# EasyEDA Pro project PID调试器.eprj

# Schematic Schematic1
Board Name: Board1; Create Date: 2025-07-22; Page Name: P1; Project Name: PID调试器; Schematic Name: Schematic1; Update Date: 2025-07-23; Company: 嘉立创EDA; Page Size: A4; Version: V1.0
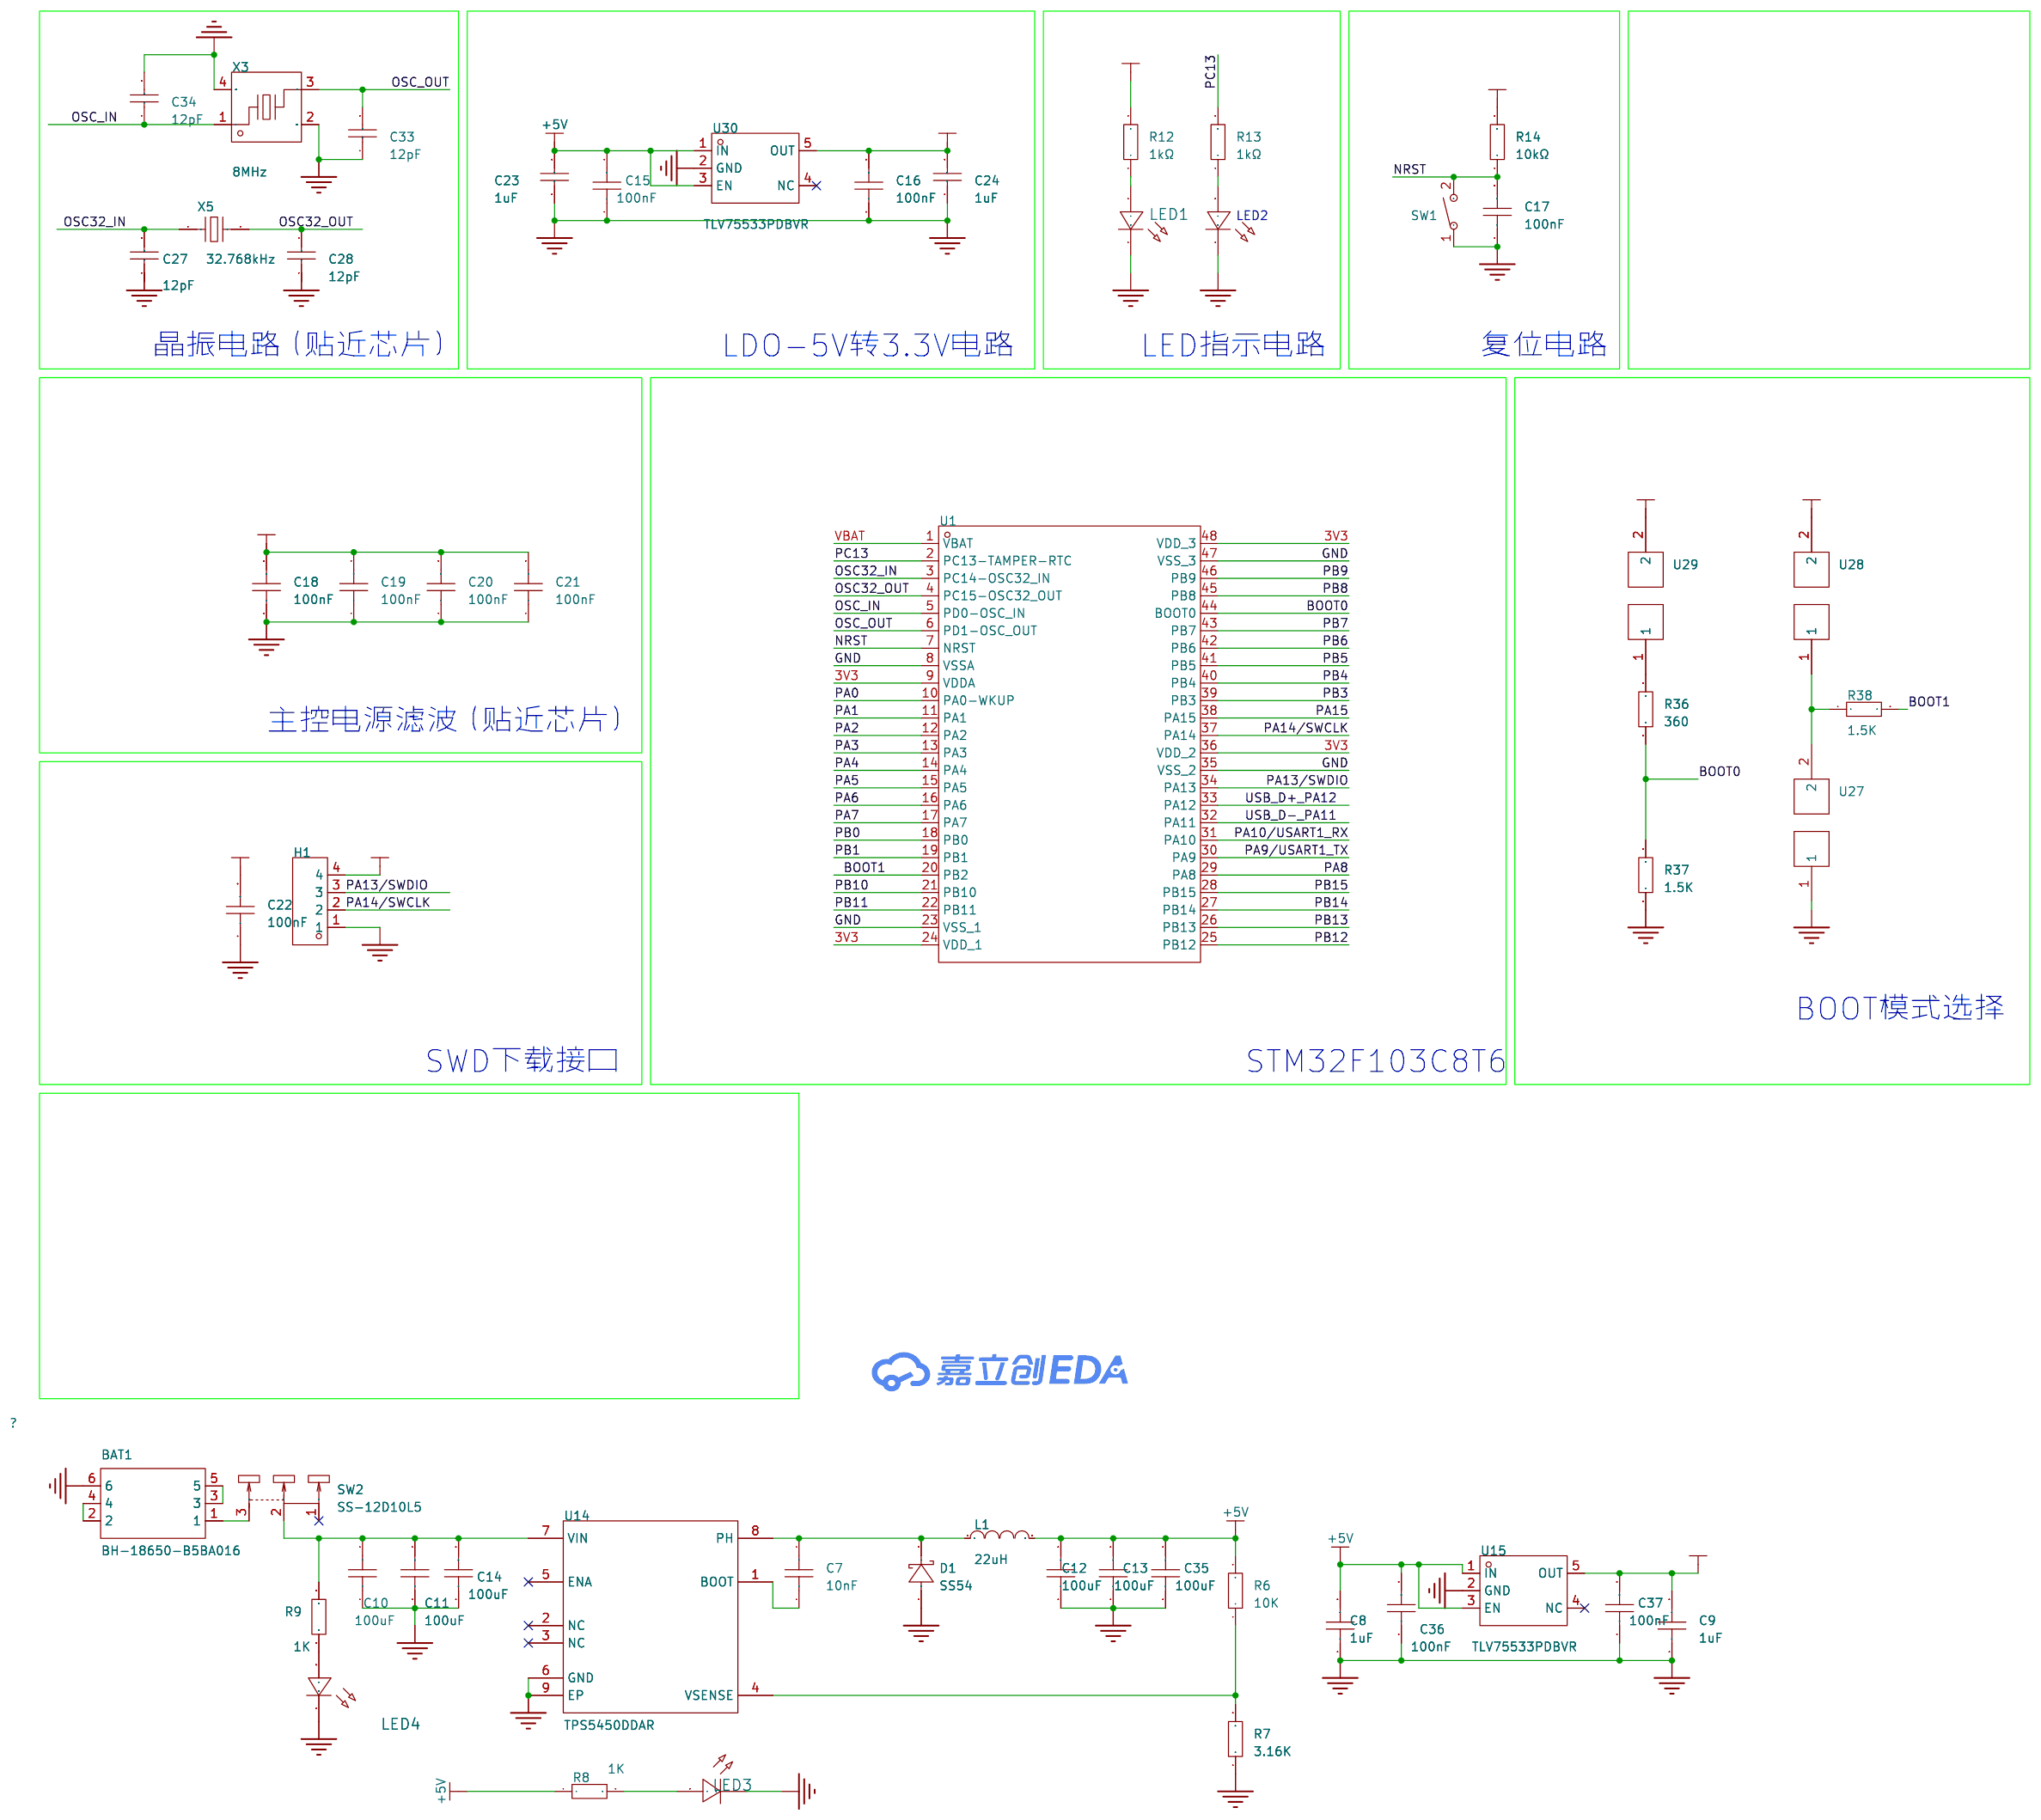
[diagram p0: schematic sheet]

## Parts
BAT1  BH-18650-B5BA016  [BAT-SMD_BH-18650-B5BA016]
C7  100nF  [C0603]
C8  100nF  [C0603]
C9  100nF  [C0603]
C10  100uF  [C1206]
C11  100uF  [C1206]
C12  100uF  [C1206]
C13  100uF  [C1206]
C14  100uF  [C1206]
C15  100nF  [R0402]
C16  100nF  [R0402]
C17  100nF  [R0402]
C18  100nF  [R0402]
C19  100nF  [R0402]
C20  100nF  [R0402]
C21  100nF  [R0402]
C22  100nF  [R0402]
C23  1uF  [R0402]
C24  1uF  [R0402]
C27  12pF  [R0402]
C28  12pF  [R0402]
C33  12pF  [R0402]
C34  12pF  [R0402]
C35  100uF  [C1206]
C36  100nF  [R0402]
C37  100nF  [R0402]
D1  SS54  [SMA_L4.3-W2.6-LS5.0-FD]
H1  -  [HDR-TH_4P-P2.54-V-M]
L1  22uH  [IND-SMD_L7.1-W6.6]
LED1  -  [LED_0603]
LED2  -  [LED_0603]
LED3  -  [LED_0603]
LED4  -  [LED_0603]
R6  10K  [R0603]
R7  10K  [R0603]
R8  1K  [R0603]
R9  1K  [R0603]
R12  1kΩ  [R0402]
R13  1kΩ  [R0402]
R14  10kΩ  [R0402]
R36  360  [R0603]
R37  1.5K  [R0603]
R38  1.5K  [R0603]
SW1  TS-1101-B-W  [KEY-SMD_2P-L6.0-W3.6-P7.4-LS8.0-L]
SW2  SS-12D10L5  [SW-TH_SS-12D10L5]
U1  STM32F103C8T6  [LQFP-48_L7.0-W7.0-P0.50-LS9.0-BL]
U14  TPS5450DDAR  [SOP-8_L4.9-W3.9-P1.27-LS6.0-BL-EP]
U15  TLV75533PDBVR  [SOT-23-5_L3.0-W1.7-P0.95-LS2.8-BR]
U27  -  [空焊盘]
U28  -  [空焊盘]
U29  -  [空焊盘]
U30  TLV75533PDBVR  [SOT-23-5_L3.0-W1.7-P0.95-LS2.8-BR]
X3  8MHz  [CRYSTAL-SMD_4P-L3.2-W2.5-BL-1]
X5  32.768kHz  [OSC-SMD_L3.2-W1.5]

## Library data of the parts
BAT1 = BH-18650-B5BA016: LCSC Part Name: 电池盒; Supplier Part: C19184086; Manufacturer: MYOUNG(美阳); Supplier Footprint: SMD; JLCPCB Part Class: 扩展库; Datasheet: https://atta.szlcsc.com/upload/public/pdf/source/20231108/D1617EC59CD55304B33DC60D90FEF183.pdf; Supplier: LCSC; Connector Type: 电池盒; Contact Plating: 金; Operating Temperature Range: -25℃~+85℃
C7-C9 = CAP_0603: Supplier Footprint: 0603
C10-C14 C35 = HGC1206R5107M100NSPJ: 容值:100uF;精度:±20%;额定电压:10V;材质(温度系数):X5R;; LCSC Part Name: 100uF ±20% 10V; Supplier Part: C7432784; Manufacturer: Chinocera(华瓷); Supplier Footprint: 1206; JLCPCB Part Class: 扩展库; Datasheet: https://atta.szlcsc.com/upload/public/pdf/source/20240320/FAC3FEC40A78BC5CCCE96C232A94D860.pdf; Supplier: LCSC; Tolerance: ±20%; Voltage Rated: 10V; Temperature Coefficient: X5R
C15-C22 C36 C37 = GRM155R71H104KE14D: 容值:100nF;精度:±10%;额定电压:50V;材质(温度系数):X7R;; LCSC Part Name: 100nF ±10% 50V; Supplier Part: C77020; Manufacturer: muRata(村田); Supplier Footprint: 0402; JLCPCB Part Class: 扩展库; Datasheet: https://atta.szlcsc.com/upload/public/pdf/source/20180326/C77020_39BD49C951FF1AF0DB1F1FAC5AC1E401.pdf; Supplier: LCSC; Tolerance: ±10%; Voltage Rated: 50V; Temperature Coefficient: X7R
C23 C24 = CL05A105KP5NNNC: 容值:1uF;精度:±10%;额定电压:10V;材质(温度系数):X5R;; LCSC Part Name: 1uF ±10% 10V; Supplier Part: C14445; Manufacturer: SAMSUNG(三星); Supplier Footprint: 0402; JLCPCB Part Class: 扩展库; Datasheet: https://atta.szlcsc.com/upload/public/pdf/source/20160218/1457707763339.pdf; Supplier: LCSC; Tolerance: ±10%; Voltage Rated: 10V; Temperature Coefficient: X5R
C27 C28 C33 C34 = 0402CG120J500NT: 容值:12pF;精度:±5%;额定电压:50V;材质(温度系数):C0G;; LCSC Part Name: 12pF ±5% 50V; Supplier Part: C1547; Manufacturer: FH(风华); Supplier Footprint: 0402; JLCPCB Part Class: 基础库; Datasheet: https://atta.szlcsc.com/upload/public/pdf/source/20200305/C486355_26A10D38EF8C2A5C37091D0039909270.pdf; Supplier: LCSC; Tolerance: ±5%; Voltage Rated: 50V; Temperature Coefficient: C0G
D1 = SS54_C7420369: 二极管配置:独立式;正向压降(Vf):550mV@5.0A;直流反向耐压(Vr):40V;整流电流:5A;; LCSC Part Name: 电压:40V 电流:5A; Supplier Part: C7420369; Manufacturer: 宏迦橙; Supplier Footprint: SMA(DO-214AC); Datasheet: https://atta.szlcsc.com/upload/public/pdf/source/20230828/254C3882F8647358AD9F60DD73611B5E.pdf; Supplier: LCSC; Diode Configuration: 独立式; Forward Voltage (Vf@If): 550mV@5.0A; Reverse Voltage (Vr): 40V; Rectified Current: 5A; Reverse Leakage Current (Ir): 50uA@40V
H1 = HDR-M_2.54_1x4P: Supplier Part: C2935929; Supplier Footprint: 插件
L1 = YSPI0630A-220M: 电感值:22uH;精度:±20%;额定电流:3A;; LCSC Part Name: 22uH ±20%; Supplier Part: C497873; Manufacturer: YJYCOIN(益嘉源); Supplier Footprint: SMD,6.6x7.1mm; JLCPCB Part Class: 扩展库; Datasheet: https://atta.szlcsc.com/upload/public/pdf/source/20200317/C497869_D09F597887D5FB8B541C5C98B400E286.pdf; Supplier: LCSC; Tolerance: ±20%; Rated Current: 3A; DC Resistance (DCR): 130mΩ
LED1 = LED_0603-R: Supplier Footprint: 0603; Supplier Part: C84263
LED2 = LED_0603-B: Supplier Footprint: 0603; Supplier Part: C84266
LED3 LED4 = LED_0603-R: Supplier Footprint: 0603
R6-R9 R36-R38 = Res_0603: Supplier Footprint: 0603
R12 R13 = 0402WGF1001TCE: 电阻类型:厚膜电阻;阻值:1kΩ;精度:±1%;功率:62.5mW;最大工作电压:50V;温度系数:±100ppm/℃;; LCSC Part Name: 1kΩ ±1% 62.5mW 厚膜电阻; Supplier Part: C11702; Manufacturer: UNI-ROYAL(厚声); Supplier Footprint: 0402; JLCPCB Part Class: 基础库; Datasheet: https://atta.szlcsc.com/upload/public/pdf/source/20200306/C422600_1E6D84923E4A46A82E41ADD87F860B5C.pdf; Supplier: LCSC; Type: 厚膜电阻; Tolerance: ±1%; Power(Watts): 62.5mW; Overload Voltage (Max): 50V; Temperature Coefficient: ±100ppm/℃; Operating Temperature Range: -55℃~+155℃
R14 = RC0402FR-0710KL: 电阻类型:厚膜电阻;阻值:10kΩ;精度:±1%;功率:62.5mW;最大工作电压:50V;温度系数:±100ppm/℃;; LCSC Part Name: 厚膜电阻 10kΩ ±1% 62.5mW; Supplier Part: C60490; Manufacturer: YAGEO(国巨); Supplier Footprint: 0402; JLCPCB Part Class: 扩展库; Datasheet: https://atta.szlcsc.com/upload/public/pdf/source/20170925/C131467_1506321478108990263.pdf; Supplier: LCSC; Type: 厚膜电阻; Tolerance: ±1%; Power(Watts): 62.5mW; Overload Voltage (Max): 50V; Temperature Coefficient: ±100ppm/℃; Operating Temperature Range: -55℃~+155℃
SW1 = TS-1101-B-W_C500065: 触点电流:50mA;额定电压(DC):12V;绝缘电阻:-;电路结构:单刀单掷;安装方式:立贴;带灯:无;作用力:160gf;机械寿命:5万次;带支架:否;; LCSC Part Name: 6*3.6*2.5mm 立贴 轻触开关; Supplier Part: C500065; Manufacturer: XKB Connectivity(中国星坤); Supplier Footprint: SMD; JLCPCB Part Class: 扩展库; Datasheet: https://atta.szlcsc.com/upload/public/pdf/source/20211011/D0E0CAF534F7B19DDE4CE68748A25BD3.pdf; Supplier: LCSC; Contact Current: 50mA; Voltage Rating (DC): 12V; Circuit: 单刀单掷; Mounting Style: 立贴; Actuator Style: 矩形按钮; Actuator/Cap Color: 白色; With Lamp: 无; Operating Force: 160gf; Mechanical Life: 5万次; Operating Temperature: -30℃~+85℃; Switch Length: 6mm; Switch Width: 3.6mm; Switch Height: 2.5mm; Strike Gundam: 否
SW2 = SS-12D10L5: 电路结构:单刀双掷;安装方式:直插;开关颜色:黑色;额定电流(DC):3A;额定电压(DC):125V;额定电流(AC):3A;额定电压(AC):125V;机械寿命:1万次;; LCSC Part Name: 柄长5mm 直插双档 滑动开关; Supplier Part: C319012; Manufacturer: XKB Connectivity(中国星坤); Supplier Footprint: 插件; Datasheet: https://atta.szlcsc.com/upload/public/pdf/source/20211009/D6412F37AABE6F9459A6EE7FA4DAEADB.pdf; Supplier: LCSC; Circuit: 单刀双掷; Actuator Style: 矩形柱状; Pin Style: PC引脚; Switch Length: 13mm; Switch Width: 6.8mm; Switch Height: 6.4mm; Mounting Style: 直插; Actuator Color: 黑色; Current Rating (DC): 3A; Voltage Rating (DC): 125V; Current Rating (AC): 3A; Voltage Rating (AC): 125V; Mechanical Life: 1万次; Operating Temperature: -40℃~+85℃
U1 = STM32F103C8T6: CPU内核:CM3;程序存储容量:64KB;RAM总容量:20KB;GPIO端口数量:37;工作电压范围:2V~3.6V;CPU最大主频:72MHz;程序存储器类型:FLASH;; LCSC Part Name: STM32F103C8T6 MSL=3; Supplier Part: C8734; Manufacturer: ST(意法半导体); Supplier Footprint: LQFP-48(7x7); JLCPCB Part Class: 扩展库; Datasheet: https://atta.szlcsc.com/upload/public/pdf/source/20220812/8363ACEC51AD55ECEB84799464F7CB85.pdf; Supplier: LCSC; CPU Core: CM3; Program Storage Size: 64KB; RAM Size: 20KB; GPIO Ports Number: 37; Operating Voltage Range: 2V~3.6V; CPU Maximum Speed: 72MHz; Program Memory Type: FLASH; Operating Temperature Range: -40℃~+85℃; ADC (Bit): 12bit; Universal Serial Bus: 有; Peripheral/Function: 看门狗；DMA；看门狗；片载温度传感器; Watchdog: 有; Infrared Data Association: 有; Low-Voltage Detect: 有; Direct Memory Access: 有; Internal Oscillator: 有
U14 = TPS5450DDAR: 功能类型:降压型;输出类型:可调;工作电压:5.5V~36V;输出电压:1.221V~31.32V;输出电流:5A;; LCSC Part Name: 5A宽输入范围降压转换器; Supplier Part: C114425; Manufacturer: TI(德州仪器); Supplier Footprint: SOP-8-EP-150mil; JLCPCB Part Class: 扩展库; Datasheet: https://www.ti.com/cn/lit/gpn/tps5450; Supplier: LCSC; Function: 降压型; Output Type: 可调; Input Voltage: 5.5V~36V; Output Voltage: 1.221V~31.32V; Output Current: 5A; Switching Frequency: 500kHz; Operating Temperature: -40℃~+125℃@(TJ); Synchronous Rectification: 否; Number of Outputs: 1; Topology: 降压式; Switch tube (built-in/external): 内置
U15 U30 = TLV75533PDBVR: 输出类型:固定;最大输入电压:5.5V;输出电压:3.3V;输出电流:500mA;电源纹波抑制比(PSRR):52dB;输出极性:正极;; LCSC Part Name: 具有使能功能的 500mA、高 PSRR、低 IQ、低压降稳压器; Supplier Part: C404027; Manufacturer: TI(德州仪器); Supplier Footprint: SOT-23-5; JLCPCB Part Class: 扩展库; Datasheet: https://www.ti.com/cn/lit/gpn/tlv755p; Supplier: LCSC; Output Type: 固定; Maximum Input Voltage: 5.5V; Output Voltage: 3.3V; Output Current: 500mA; Power Supply Rejection Ratio (PSRR): 52dB; Dropout Voltage: 238mV@(500mA); standby current: 31uA; Feature: 防静电保护；浪涌保护；低ESR；热保护(TSD)；欠压闭锁；过流保护(OCP)；带使能; Operating Temperature: -40℃~+125℃@(Tj); Output Polarity: 正极; Number of Outputs: 1
U27-U29 = 空焊盘
X3 = XL2EL89COI-111YLC-8M: 晶振类型:贴片晶振;频率:8MHz;常温频差:±10ppm;外接负载电容:12pF;频率稳定度(全温):±20ppm;; LCSC Part Name: 8MHz ±10ppm 12pF; Supplier Part: C2973805; Manufacturer: YXC(扬兴晶振); Supplier Footprint: SMD3225-4P; JLCPCB Part Class: 扩展库; Datasheet: https://atta.szlcsc.com/upload/public/pdf/source/20240329/19D5F850207469550BEB00D7DFEDBC7A.pdf; Supplier: LCSC; Crystal Type: 贴片晶振; Normal temperature Frequency Tolerance: ±10ppm; External load capacitor: 12pF; Frequency Stability(Full temperature range): ±20ppm; Equivalent Series Resistance (ESR): 150Ω; Operating Temperature: -40℃~+85℃
X5 = X321532768KGD2SI: 晶振类型:贴片晶振;频率:32.768kHz;常温频差:±20ppm;外接负载电容:12.5pF;频率稳定度(全温):-;; LCSC Part Name: 32.768kHz ±20ppm 12.5pF; Supplier Part: C620155; Manufacturer: YXC(扬兴晶振); Supplier Footprint: SMD3215-2P; JLCPCB Part Class: 扩展库; Datasheet: https://atta.szlcsc.com/upload/public/pdf/source/20240329/3A7650FD985DD0DE85694D3785AB4916.pdf; Supplier: LCSC; Crystal Type: 贴片晶振; Normal temperature Frequency Tolerance: ±20ppm; External load capacitor: 12.5pF; Operating Temperature: -40℃~+85℃

## Nets
3V3: C9.2 C18.2 C19.2 C20.2 C21.2 C22.2 C37.2 H1.4 R12.2 R14.2 U1.9(VDDA) U1.24(VDD_1) U1.36(VDD_2) U1.48(VDD_3) U15.5(OUT) U28.2 U29.2
+5V: C8.2 C12.2 C13.2 C15.2 C23.2 C35.2 C36.2 L1.2 R6.2 R8.1 U15.1(IN) U15.3(EN) U30.1(IN) U30.3(EN)
GND: BAT1.6 C8.1 C9.1 C10.1 C11.1 C12.1 C13.1 C14.1 C15.1 C16.1 C17.1 C18.1 C19.1 C20.1 C21.1 C22.1 C23.1 C24.1 C27.1 C28.1 C33.1 C34.2 C35.1 C36.1 C37.1 D1.1(A) H1.1 LED1.1(C) LED2.1(C) LED3.1(C) LED4.1(C) R7.1 R37.1 SW1.1 U1.8(VSSA) U1.23(VSS_1) U1.35(VSS_2) U1.47(VSS_3) U14.6(GND) U14.9(EP) U15.2(GND) U27.1 U30.2(GND) X3.2(GND) X3.4(GND)
VBAT: U1.1(VBAT)
ADC_3V3: C16.2 C24.2 U30.5(OUT)
BOOT0: R36.1 R37.2 U1.44(BOOT0)
BOOT1: R38.2 U1.20(PB2)
NRST: C17.2 R14.1 SW1.2 U1.7(NRST)
OSC32_IN: C27.2 U1.3(PC14-OSC32_IN) X5.1
OSC32_OUT: C28.2 U1.4(PC15-OSC32_OUT) X5.2
OSC_IN: C34.1 U1.5(PD0-OSC_IN) X3.1
OSC_OUT: C33.2 U1.6(PD1-OSC_OUT) X3.3
PA0: U1.10(PA0-WKUP)
PA1: U1.11(PA1)
PA2: U1.12(PA2)
PA3: U1.13(PA3)
PA4: U1.14(PA4)
PA5: U1.15(PA5)
PA6: U1.16(PA6)
PA7: U1.17(PA7)
PA8: U1.29(PA8)
PA9/USART1_TX: U1.30(PA9)
PA10/USART1_RX: U1.31(PA10)
PA13/SWDIO: H1.3 U1.34(PA13)
PA14/SWCLK: H1.2 U1.37(PA14)
PA15: U1.38(PA15)
PB0: U1.18(PB0)
PB1: U1.19(PB1)
PB3: U1.39(PB3)
PB4: U1.40(PB4)
PB5: U1.41(PB5)
PB6: U1.42(PB6)
PB7: U1.43(PB7)
PB8: U1.45(PB8)
PB9: U1.46(PB9)
PB10: U1.21(PB10)
PB11: U1.22(PB11)
PB12: U1.25(PB12)
PB13: U1.26(PB13)
PB14: U1.27(PB14)
PB15: U1.28(PB15)
PC13: R13.2 U1.2(PC13-TAMPER-RTC)
USB_D+_PA12: U1.33(PA12)
USB_D-_PA11: U1.32(PA11)
$1N1992: LED1.2(A) R12.1
$1N1995: LED2.2(A) R13.1
$1N3257: R38.1 U27.2 U28.1
$1N3260: R36.2 U29.1
$1N4251: C10.2 C11.2 C14.2 R9.2 SW2.2 U14.7(VIN)
$1N4254: C7.2 D1.2(K) L1.1 U14.8(PH)
$1N4256: C7.1 U14.1(BOOT)
$1N4260: R6.1 R7.2 U14.4(VSENSE)
$1N4266: LED3.2(A) R8.2
$1N4269: LED4.2(A) R9.1
$1N4271: BAT1.1 SW2.3
$1N6190: BAT1.2 BAT1.4
$1N6207: BAT1.3 BAT1.5

Not connected (* = marked no-connect by the designer): SW2 1*; U14 2(NC)* 3(NC)* 5(ENA)*; U15 4(NC)*; U30 4(NC)*

## Notes on the sheet
- 晶振电路（贴近芯片）
- LDO-5V转3.3V电路
- LED指示电路
- 复位电路
- 主控电源滤波（贴近芯片）
- BOOT模式选择
- SWD下载接口
- STM32F103C8T6

# Board PCB1
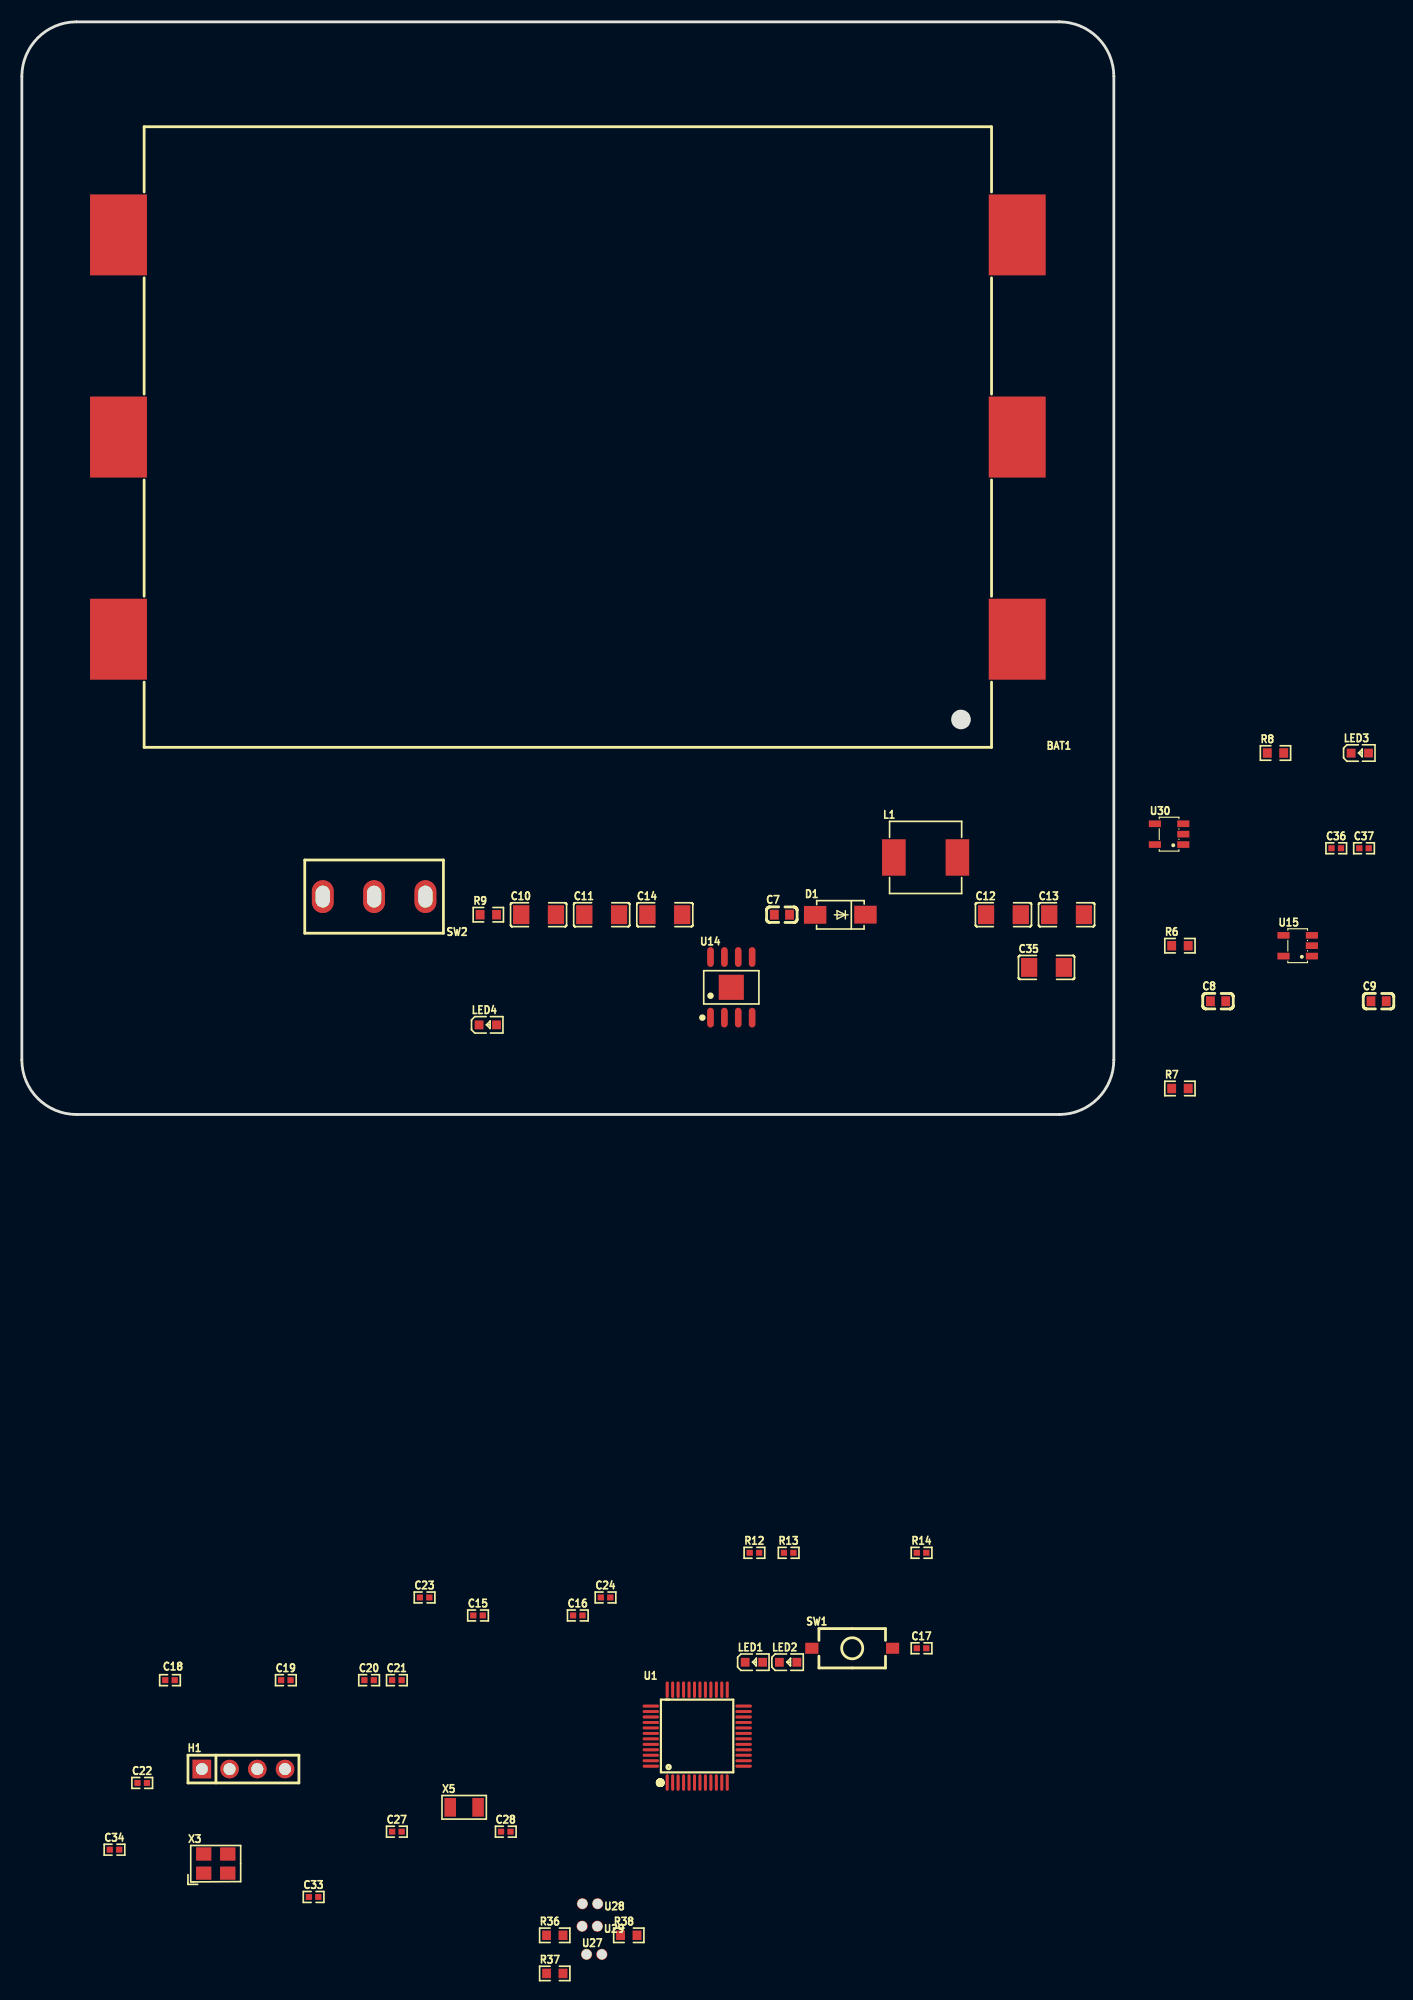
[diagram p1: board, top side]
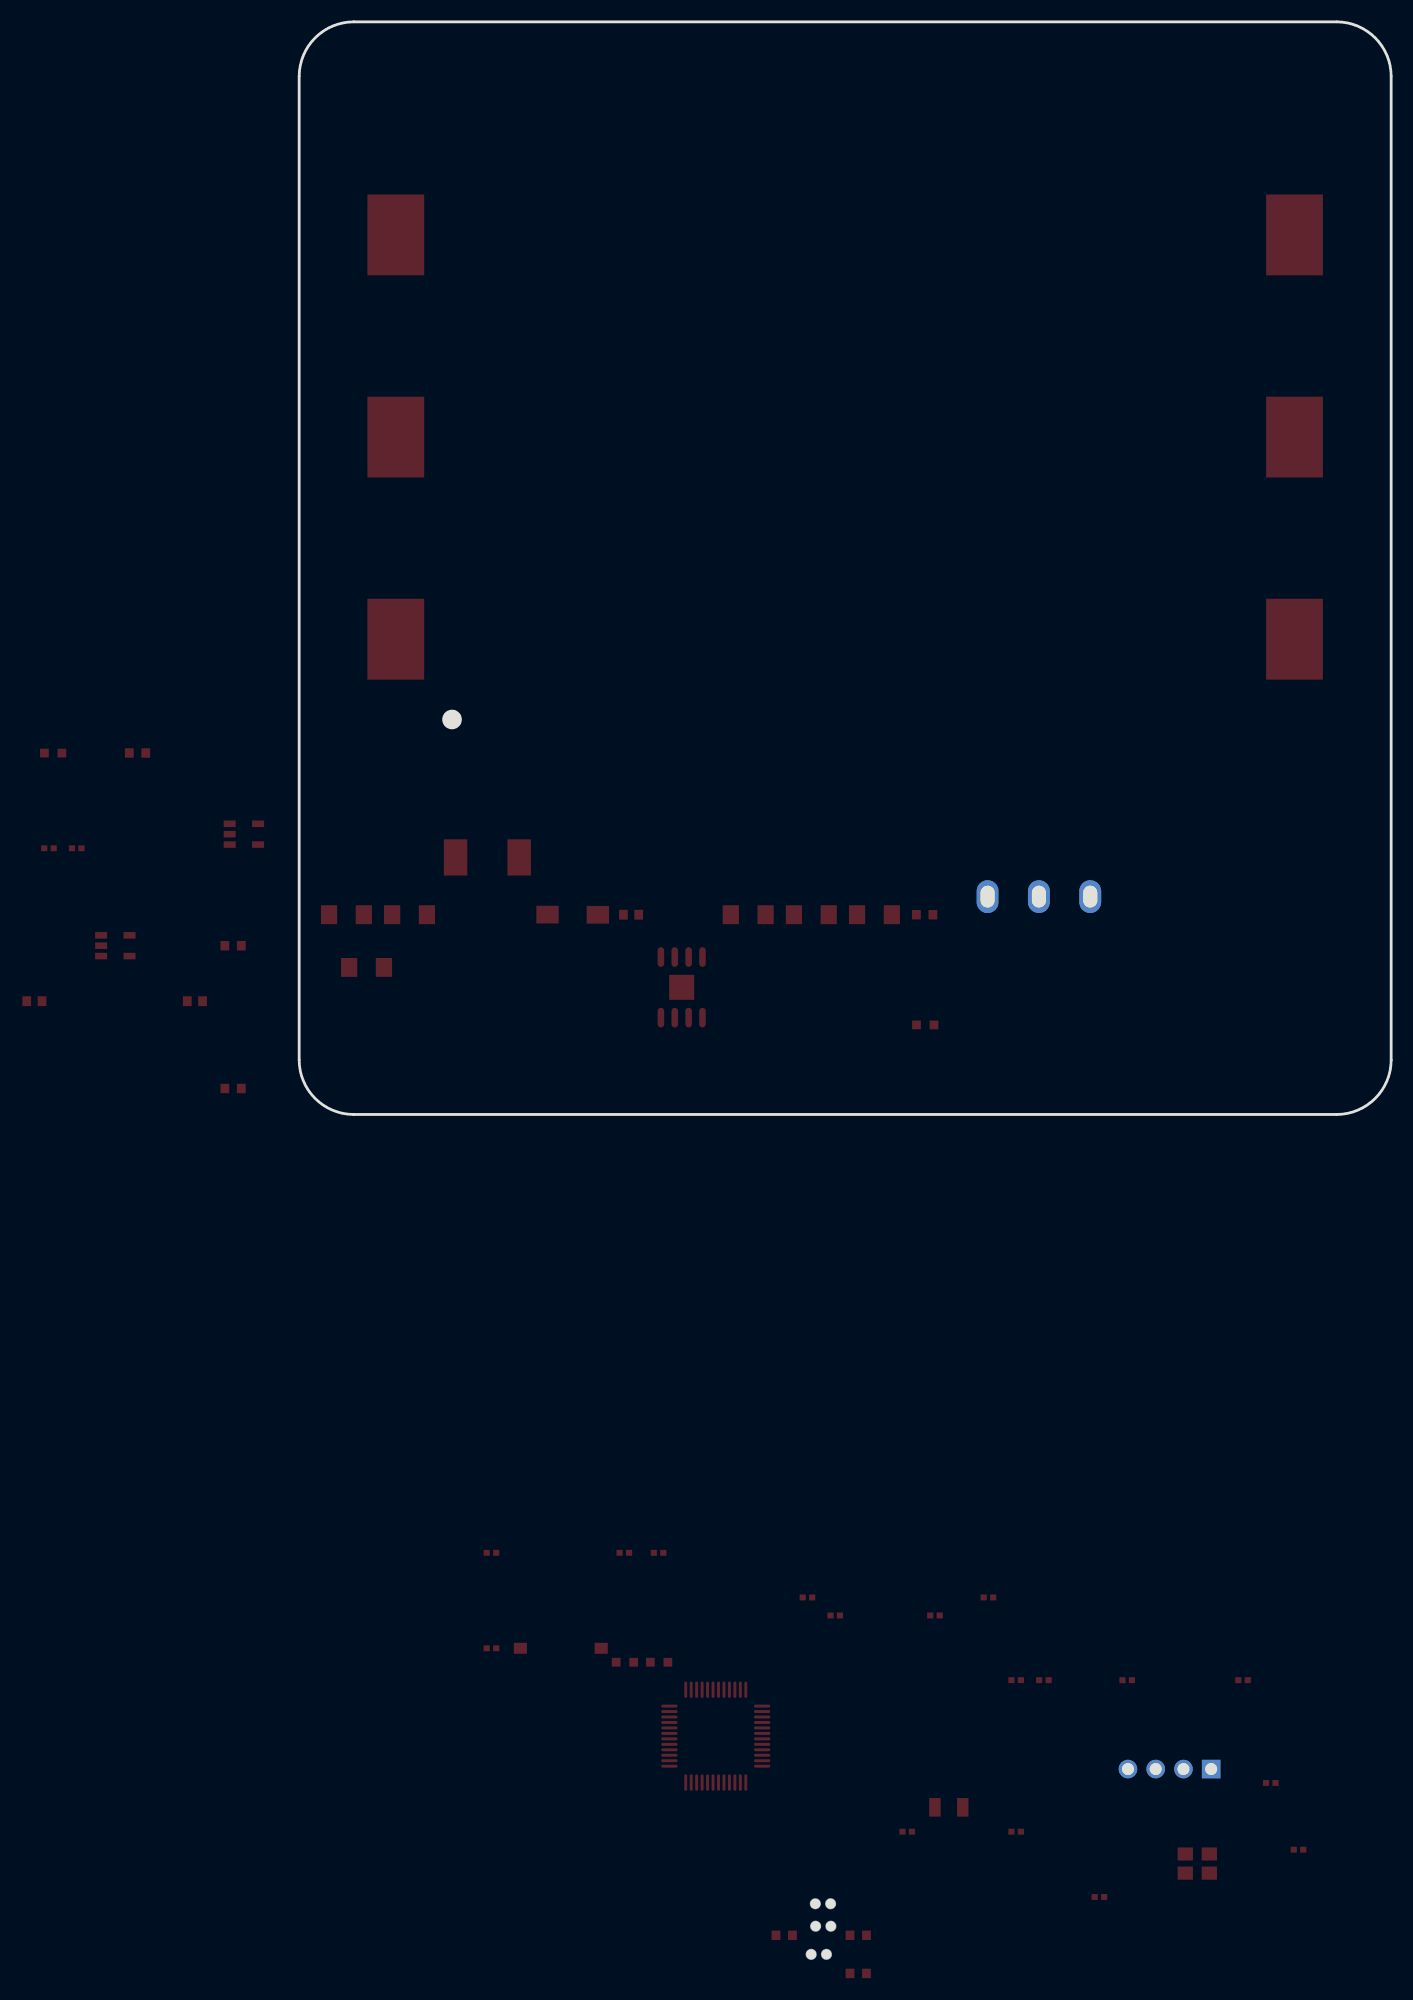
[diagram p2: board, bottom side, seen from below]

Outline 100 x 100 mm; copper layers: Top Layer, Bottom Layer. Coordinates in mm from the lower left corner of the outline.
Outline path: 0,95 0,5 arc(1.46,1.46) 5,0 95,0 arc(98.54,1.46) 100,5 100,95 arc(98.54,98.54) 95,100 5,100 arc(1.46,98.54) 0,95
Stack: Top Layer 0.035mm / Dielectric1 1.51mm FR4 er 4.5 / Bottom Layer 0.035mm

## Design rules (mm)
template: JLCPCB Capability(Two Layers Board)
spacing copperThickness1oz (default): track to track 0.102, other pairs 0.152 to 0.3
spacing copperThickness2oz: track to track 0.203, other pairs 0.152 to 0.3
track width copperThickness1oz (default): min 0.127, default 0.254, max 2.54
track width copperThickness2oz: min 0.203, default 0.254, max 2.54
differential pair differentialPair (default): width min 0.127, default 0.254, max 2.54; gap min 0.152, default 0.152
via viaSize (default): diameter min 0.5, default 0.61, max 10; hole min 0.3, default 0.305, max 6.3

## Placement (name value [footprint] x y rotation side)
BAT1  BH-18650-B5BA016  [BAT-SMD_BH-18650-B5BA016]  50 62 180 top
C7  100nF  [C0603]  69.6 18.28 0 top
C8  100nF  [C0603]  109.55 10.37 0 top
C9  100nF  [C0603]  124.25 10.37 0 top
C10  100uF  [C1206]  47.32 18.28 0 top
C11  100uF  [C1206]  53.1 18.28 0 top
C12  100uF  [C1206]  89.89 18.28 0 top
C13  100uF  [C1206]  95.67 18.28 0 top
C14  100uF  [C1206]  58.88 18.28 0 top
C15  100nF  [R0402]  41.78 -45.85 0 top
C16  100nF  [R0402]  50.91 -45.85 0 top
C17  100nF  [R0402]  82.39 -48.85 0 top
C18  100nF  [R0402]  13.57 -51.77 180 top
C19  100nF  [R0402]  24.18 -51.77 0 top
C20  100nF  [R0402]  31.8 -51.77 0 top
C21  100nF  [R0402]  34.34 -51.77 0 top
C22  100nF  [R0402]  11.02 -61.18 0 top
C23  1uF  [R0402]  36.88 -44.2 0 top
C24  1uF  [R0402]  53.45 -44.2 0 top
C27  12pF  [R0402]  34.34 -65.64 0 top
C28  12pF  [R0402]  44.32 -65.64 0 top
C33  12pF  [R0402]  26.72 -71.62 0 top
C34  12pF  [R0402]  8.48 -67.29 0 top
C35  100uF  [C1206]  93.83 13.46 0 top
C36  100nF  [R0402]  120.37 24.37 0 top
C37  100nF  [R0402]  122.91 24.37 0 top
D1  SS54  [SMA_L4.3-W2.6-LS5.0-FD]  74.95 18.28 0 top
H1  -  [HDR-TH_4P-P2.54-V-M]  20.29 -59.91 0 top
L1  22uH  [IND-SMD_L7.1-W6.6]  82.76 23.53 0 top
LED1  -  [LED_0603]  67.09 -50.12 0 top
LED2  -  [LED_0603]  70.22 -50.12 0 top
LED3  -  [LED_0603]  122.58 33.08 0 top
LED4  -  [LED_0603]  42.72 8.21 0 top
R6  10K  [R0603]  106.05 15.45 0 top
R7  10K  [R0603]  106.05 2.38 0 top
R8  1K  [R0603]  114.8 33.08 0 top
R9  1K  [R0603]  42.72 18.28 0 top
R12  1kΩ  [R0402]  67.09 -40.12 0 top
R13  1kΩ  [R0402]  70.22 -40.12 0 top
R14  10kΩ  [R0402]  82.39 -40.12 0 top
R36  360  [R0603]  48.8 -75.12 0 top
R37  1.5K  [R0603]  48.8 -78.61 0 top
R38  1.5K  [R0603]  55.58 -75.12 0 top
SW1  TS-1101-B-W  [KEY-SMD_2P-L6.0-W3.6-P7.4-LS8.0-L]  76.04 -48.85 0 top
SW2  SS-12D10L5  [SW-TH_SS-12D10L5]  32.26 19.94 180 top
U1  STM32F103C8T6  [LQFP-48_L7.0-W7.0-P0.50-LS9.0-BL]  61.85 -56.9 0 top
U14  TPS5450DDAR  [SOP-8_L4.9-W3.9-P1.27-LS6.0-BL-EP]  64.97 11.64 0 top
U15  TLV75533PDBVR  [SOT-23-5_L3.0-W1.7-P0.95-LS2.8-BR]  116.84 15.45 0 top
U27  -  [空焊盘]  51.72 -76.87 0 top
U28  -  [空焊盘]  52.73 -72.24 180 top
U29  -  [空焊盘]  52.71 -74.29 180 top
U30  TLV75533PDBVR  [SOT-23-5_L3.0-W1.7-P0.95-LS2.8-BR]  105.06 25.66 0 top
X3  8MHz  [CRYSTAL-SMD_4P-L3.2-W2.5-BL-1]  17.75 -68.56 0 top
X5  32.768kHz  [OSC-SMD_L3.2-W1.5]  40.51 -63.41 0 top

## Footprints (pads in the part's own frame, mm; a bottom-side part is the same pattern mirrored in y, then rotated)
BAT-SMD_BH-18650-B5BA016
  rect 5.2x7.4 smd: 1(-41.15,18.5) 2(41.15,18.5) 3(-41.15,0) 4(41.15,0) 5(-41.15,-18.5) 6(41.15,-18.5)
C0603
  rect 0.8x0.9 smd: 1(-0.7,0) 2(0.7,0)
C1206
  rect 1.485x1.728 smd: 1(-1.593,0) 2(1.593,0)
CRYSTAL-SMD_4P-L3.2-W2.5-BL-1
  rect 1.4x1.2 smd: 1(-1.1,-0.875) 2(1.1,-0.875) 3(1.1,0.875) 4(-1.1,0.875)
HDR-TH_4P-P2.54-V-M
  rect 1.7x1.7 hole 1.1: 1(-3.81,0)
  round 1.7 hole 1.1: 2(-1.27,0) 3(1.27,0) 4(3.81,0)
IND-SMD_L7.1-W6.6
  rect 2.15x3.32 smd: 1(-2.913,0) 2(2.913,0)
KEY-SMD_2P-L6.0-W3.6-P7.4-LS8.0-L
  rect 1.2x1 smd: 1(-3.7,0) 2(3.7,0)
LED_0603
  rect 0.8x0.8 smd: 1(-0.851,-0.01) 2(0.75,-0.005)
LQFP-48_L7.0-W7.0-P0.50-LS9.0-BL
  oval 0.27x1.5 smd: 1(-2.75,-4.25) 2(-2.25,-4.25) 3(-1.75,-4.25) 4(-1.25,-4.25) 5(-0.75,-4.25) 6(-0.25,-4.25) 7(0.25,-4.25) 8(0.75,-4.25) 9(1.25,-4.25) 10(1.75,-4.25) 11(2.25,-4.25) 12(2.75,-4.25) 25(2.75,4.25) 26(2.25,4.25) 27(1.75,4.25) 28(1.25,4.25) 29(0.75,4.25) 30(0.25,4.25) 31(-0.25,4.25) 32(-0.75,4.25) 33(-1.25,4.25) 34(-1.75,4.25) 35(-2.25,4.25) 36(-2.75,4.25)
  oval 1.5x0.27 smd: 13(4.25,-2.75) 14(4.25,-2.25) 15(4.25,-1.75) 16(4.25,-1.25) 17(4.25,-0.75) 18(4.25,-0.25) 19(4.25,0.25) 20(4.25,0.75) 21(4.25,1.25) 22(4.25,1.75) 23(4.25,2.25) 24(4.25,2.75) 37(-4.25,2.75) 38(-4.25,2.25) 39(-4.25,1.75) 40(-4.25,1.25) 41(-4.25,0.75) 42(-4.25,0.25) 43(-4.25,-0.25) 44(-4.25,-0.75) 45(-4.25,-1.25) 46(-4.25,-1.75) 47(-4.25,-2.25) 48(-4.25,-2.75)
OSC-SMD_L3.2-W1.5
  rect 1.05x1.7 smd: 1(-1.275,0) 2(1.275,0)
R0402
  rect 0.566x0.54 smd: 1(-0.433,0) 2(0.433,0)
R0603
  rect 0.806x0.864 smd: 1(-0.753,0) 2(0.753,0)
SMA_L4.3-W2.6-LS5.0-FD
  rect 2.046x1.62 smd: 1(-2.304,-0.009) 2(2.304,0.009)
SOP-8_L4.9-W3.9-P1.27-LS6.0-BL-EP
  oval 0.6x1.8 smd: 1(-1.905,-2.772) 2(-0.635,-2.772) 3(0.635,-2.772) 4(1.905,-2.772) 5(1.905,2.772) 6(0.635,2.772) 7(-0.635,2.772) 8(-1.905,2.772)
  rect 2.29x2.29 smd: 9(0,0)
SOT-23-5_L3.0-W1.7-P0.95-LS2.8-BR
  rect 1.1x0.6 smd: 1(1.3,-0.95) 2(1.3,0) 3(1.3,0.95) 4(-1.3,0.95) 5(-1.3,-0.95)
SW-TH_SS-12D10L5
  oval 2x3 hole 1.3x2: 1(-4.7,0) 2(0,0) 3(4.7,0)
空焊盘
  round 1.016 hole 0.914x0.003: 1(0,0) 2(1.397,0)

## Nets
As in the schematic.

Pads without a net: SW2 1; U14 2 3 5; U15 4; U30 4
